# EAGLE design einstein_v1_1 (EAGLE 8.4.1)
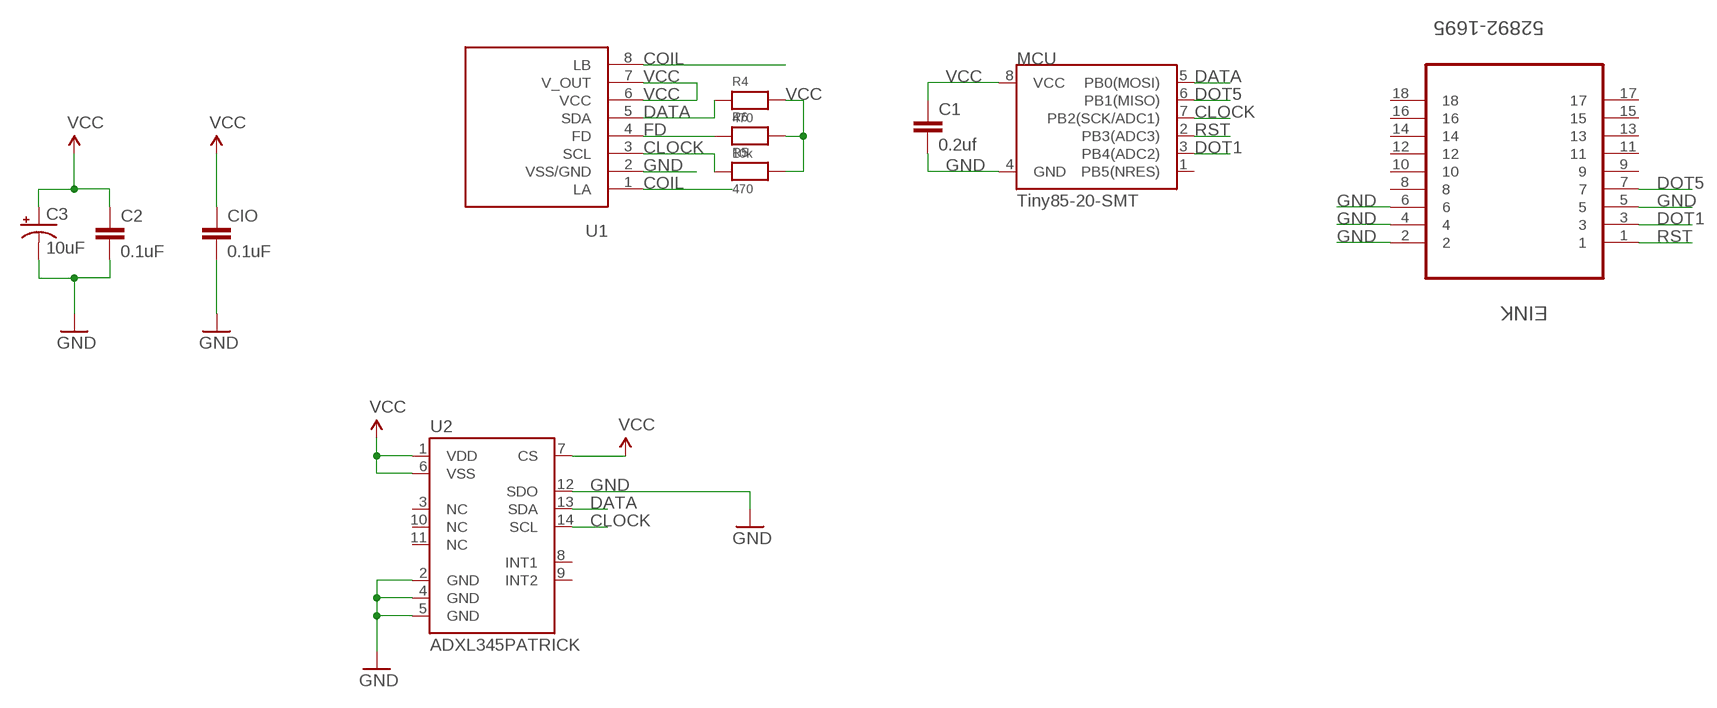
[diagram p0: schematic, sheet 1]

## Parts
C1  0.2uf  CAP1206  [1206]
C2  0.1uF  CAP0603-CAP  [0603-CAP]
C3  10uF  CAP_POL1206  [EIA3216]
CIO  0.1uF  CAP0603-CAP  [0603-CAP]
EINK  52892-1695  [MOLEX_52892-1695]
MCU  Tiny85-20-SMT  ATTINY45TINY85-20-SMT  [SO08-EIAJ]
R4  470  RESISTOR0603  [0603]
R5  470  RESISTOR0603  [0603]
R6  10k  RESISTOR0603  [0603]
U1  NT3H1101  [NT3H1101]
U2  ADXL345PATRICK  [LGA14_1:1_PATRICK]

## Nets
CLOCK: MCU.7(PB2(SCK/ADC1)) R5.1 U1.3(SCL) U2.14(SCL)
COIL: U1.1(LA) U1.8(LB)
DATA: MCU.5(PB0(MOSI)) R4.1 U1.5(SDA) U2.13(SDA)
DOT1: EINK.3 MCU.3(PB4(ADC2))
DOT5: EINK.7 MCU.6(PB1(MISO))
FD: R6.1 U1.4(FD)
GND: C1.2 C2.2 C3.C(-) CIO.2 EINK.2 EINK.4 EINK.5 EINK.6 MCU.4(GND) U1.2(VSS/GND) U2.2(GND) U2.4(GND) U2.5(GND) U2.12(SDO)
RST: EINK.1 MCU.2(PB3(ADC3))
VCC: C1.1 C2.1 C3.A(+) CIO.1 MCU.8(VCC) R4.2 R5.2 R6.2 U1.6(VCC) U1.7(V_OUT) U2.1(VDD) U2.6(VSS) U2.7(CS)
Unconnected: EINK.8 EINK.9 EINK.10 EINK.11 EINK.12 EINK.13 EINK.14 EINK.15 EINK.16 EINK.17 EINK.18 MCU.1(PB5(NRES)) U2.3(NC) U2.8(INT1) U2.9(INT2) U2.10(NC) U2.11(NC)

## Library data of the parts
C1 = SparkFun-Capacitors:CAP: Capacitor Standard 0603 ceramic capacitor, and 0.1" leaded capacitor.
C2 CIO = SparkFun:CAP: Capacitor Standard 0603 ceramic capacitor, and 0.1" leaded capacitor.
C3 = SparkFun:CAP_POL: Capacitor Polarized These are standard SMD and PTH capacitors. Normally 10uF, 47uF, and 100uF in electrolytic and tantalum varieties. Always verify the external diameter of the through hole cap, it varies with capacity, voltage, and manufacturer. The EIA devices should be standard.
EINK = Molex_By_element14_Batch_1:52892-1695: CONNECTOR, FPC, ZIF, 0.50MM, 16 WAY; MPN: 52892-1695; OC_FARNELL: 1556807; OC_NEWARK: 92M6601; PACKAGE: CONNECTOR, FPC, ZIF, 0.50MM, 16 WAY; SUPPLIER: Molex
MCU = SparkFun-DigitalIC:ATTINY45: Atmel 8-pin 2/4/8kB flash uC; PROD_ID: IC-09092
R4-R6 = microbuilder:RESISTOR: Resistors 0402 - 0402 Surface Mount Package 22 Ohm 1% 1/16W [Digikey: 311-22.0LRTR-ND] 33 Ohm 5% 1/16W 1.0K 5% 1/16W 1.5K 5% 1/16W 2.0K 1% 1/16W 10.0K 1% 1/16W [Digikey: 311-10.0KLRTR-ND] 10.0K 5% 1/16W [Digikey: RMCF0402JT10K0TR-ND] 12.1K 1% 1/16W [Digikey: 311-22.0LRTR-ND] 100.0K 5% 1/16W 0603 - 0603 Surface Mount Package 0 Ohm 1/10 Watt 1% Resistor 15 Ohm 1/10 Watt 1% Resistor 33 Ohm 1/10 Watt 1% Resistor 49.9 Ohm 1/10 Watt 1% Resistor 100 Ohm 1/10 Watt 1% Resistor 150 Ohm 1/10 Watt 1% Resistor 240 Ohm 1/10 Watt 1% Resistor 390 Ohm 1/10 Watt 1% Resistor 560 Ohm 1/10 Watt 1% Resistor 680 Ohm 1/10 Watt 1% Resistor 750 Ohm 1/10 Watt 1% Resistor 1.0K Ohm 1/10 Watt 1% Resistor 1.5K Ohm 1/10 Watt 1% Resistor 2.0K Ohm 1/10 Watt 1% Resistor 2.2K Ohm 1/10 Watt 1% Resistor 3.3K Ohm 1/10 Watt 1% Resistor 4.7K Ohm 1/10 Watt 1% Resistor 10.0K Ohm 1/10 Watt 1% Resistor 12.0K Ohm 1/10 Watt 1% Resistor 12.1K Ohm 1/10 Watt 1% Resistor 20.0K Ohm 1/10 Watt 1% Resistor 33.0K Ohm 1/10 Watt 1% Resistor 100.0K Ohm 1/10 Watt 1% Resistor 0805 - 0805 Surface Mount Package 0 Ohm 1/8 Watt 1% Resistor 33 Ohm 1/8 Watt 1% Resistor 100 Ohm 1/8 Watt 1% Resistor 150 Ohm 1/8 Watt 1% Resistor 200 Ohm 1/8 Watt 1% Resistor 240 Ohm 1/8 Watt 1% Resistor 330 Ohm 1/8 Watt 1% Resistor 390 Ohm 1/8 Watt 1% Resistor 470 Ohm 1/8 Watt 1% Resistor 1.0K Ohm 1/8 Watt 1% Resistor 1.5K Ohm 1/8 Watt 1% Resistor 2.0K Ohm 1/8 Watt 1% Resistor 4.7K Ohm 1/8 Watt 1% Resistor 5.1K Ohm 1/8 Watt 1% Resistor 5.6K Ohm 1/8 Watt 1% Resistor 10.0K Ohm 1/8 Watt 1% Resistor 22.0K Ohm 1/8 Watt 1% Resistor 33.0K Ohm 1/8 Watt 1% Resistor 100K Ohm 1/8 Watt 1% Resistor 1206 - 1206 Surface Mount Package 2012 - 2010 Surface Mount Package 0.11 Ohm 1/2 Watt 1% Resistor - Digikey: RHM.11UCT-ND
U1 = AlterNail:NT3H1101
U2 = Testing:ADXL345

## Board
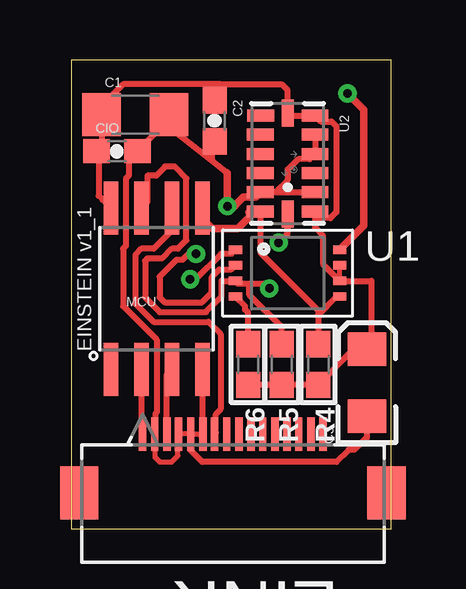
[diagram p1: board, top side]
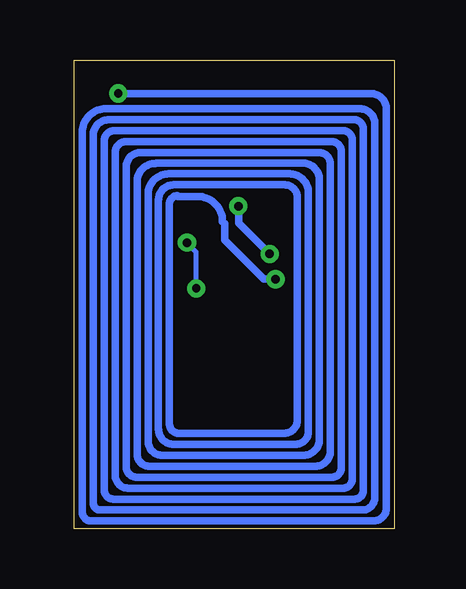
[diagram p2: board, bottom side, seen from below]

Size 13.34 x 19.56 mm. Coordinates in mm from the lower left corner, seen from the top.
Outline: 0,0 13.34,0 13.34,19.56 0,19.56 0,0
Copper layers (1*16): Top 0.035mm / dielectric 1.5mm / Bottom 0.035mm
Design rules "default *": minimum track width 10mil, minimum drill 24mil, track to track 8mil, track to pad 8mil, pad to pad 8mil, via to via 8mil, smd to smd 8mil, copper to edge 40mil, drill to drill 6mil, minimum pad ring 10mil, minimum via ring 8mil, stop-mask expansion 4mil, vias tented up to drill 0mil, thermal gap 10mil

### Footprints (pad centres in the part's own frame; a part is rotated, then mirrored left to right if it is on the bottom)
1206 = smd 1.6 x 1.8: 1 -1.4,0; 2 1.4,0
0603-CAP = smd 1.1 x 1: 1 -0.85,0; 2 0.85,0
EIA3216 = smd 1.4 x 1.6: A 1.4,0; C -1.4,0
MOLEX_52892-1695 = smd 0.305 x 1.397: 1 3.759,2.896; 2 3.251,2.896; 3 2.743,2.896; 4 2.261,2.896; 5 1.753,2.896; 6 1.245,2.896; 7 0.762,2.896; 8 0.254,2.896; 9 -0.254,2.896; 10 -0.762,2.896; 11 -1.245,2.896; 12 -1.753,2.896; 13 -2.261,2.896; 14 -2.743,2.896; 15 -3.251,2.896; 16 -3.759,2.896 | smd 1.6 x 2.21: 17 -6.401,5.359; 18 6.401,5.359
SO08-EIAJ = smd 0.61 x 2.21: 1 -1.905,-3.378; 2 -0.635,-3.378; 3 0.635,-3.378; 4 1.905,-3.378; 5 1.905,3.353; 6 0.635,3.353; 7 -0.635,3.353; 8 -1.905,3.353
0603 = smd 1.1 x 1: 1 -0.85,0; 2 0.85,0
NT3H1101 = smd 0.55 x 0.35: 1 -2.175,0.975; 2 -2.175,0.325; 3 -2.175,-0.325; 4 -2.175,-0.975; 5 2.175,-0.975; 6 2.175,-0.325; 7 2.175,0.325; 8 2.175,0.975; P$5 -2.175,-0.325
LGA14_1:1_PATRICK = smd 0.5 x 1.124: 1 2,1.138; 2 1.2,1.138; 3 0.4,1.138; 4 -0.4,1.138; 5 -1.2,1.138; 6 -2,1.138; 8 -2,-1.13; 9 -1.2,-1.138; 10 -0.4,-1.138; 11 0.4,-1.138; 12 1.2,-1.138; 13 2,-1.138 | smd 1.124 x 0.5: 7 -2.1,0; 14 2.1,0

### Placement (x,y rotation side)
C1  2.67,17.27 0 top
C2  5.97,17.02 270 top
C3  12.32,6.1 90 top
CIO  1.91,15.75 0 top
EINK  6.73,6.86 180 top
MCU  3.56,10.03 0 top
R4  10.29,6.86 270 top
R5  8.76,6.86 270 top
R6  7.37,6.86 270 top
U1  9.02,10.67 0 top
U2  9.02,15.24 270 top

### Tracks (layer width: path | path; a pad name or v marks a point on that pad's centre or on a via)
CLOCK  (via drill 0.35)
  Top 0.203: 6.77,10.41 U1.3 6.95,10.23
  Top 0.254: 8.64,8.13 R5.1 8.76,8.42 7.42,9.76 7.42,10.23 | MCU.7 3.17,13.64 3.17,14.73 3.53,14.73 3.91,15.11 4.3,15.11 4.8,14.62 4.8,12.04 4.45,11.68 4.19,11.68 3.79,11.28 3.17,11.28 3.07,11.18 3.07,9.65 3.68,9.04 5.61,9.04 6.26,9.69 6.26,10.34 U1.3 | 6.95,10.23 7.42,10.23 | 7.42,10.23 8.06,10.23 v8.25,10.03 | v8.64,11.94 9.02,12.32 U2.14
  Bottom 0.203: v8.25,10.03 8.25,11.55 v8.64,11.94
COIL  (via drill 0.35)
  Top 0.254: U1.1 6.67,11.47 6.24,11.47 5.18,10.41
  Top 0.305: 5.18,10.41 v4.95,10.41 | U1.8 12.2,12.65 12.2,17.48 v11.51,18.16
  Bottom 0.203: 10.26,3.73 10.26,3.66
  Bottom 0.305: 10.26,3.66 arc-90 9.68,3.07 3.79,3.07 arc-90 3.12,3.73 3.12,14.55 arc-90 3.83,15.27 9.93,15.27 9.96,15.24 arc-90 10.72,14.48 10.72,3.12 arc-90 10.21,2.62 3.3,2.62 arc-90 2.67,3.25 2.67,15.21 arc-90 3.15,15.7 10.57,15.7 arc-90 11.18,15.09 11.18,2.59 arc-90 10.74,2.16 2.59,2.16 arc-90 2.21,2.54 2.21,15.75 arc-90 2.62,16.15 11.18,16.15 arc-90 11.63,15.7 11.63,2.24 arc-90 11.1,1.7 2.13,1.7 arc-90 1.75,2.08 1.75,16.23 arc-90 2.13,16.61 11.66,16.61 arc-90 12.09,16.18 12.09,1.63 arc-90 11.71,1.25 1.65,1.25 arc-90 1.29,1.6 1.29,16.69 arc-90 1.68,17.07 11.89,17.07 arc-90 12.55,16.41 12.55,1.09 arc-90 12.24,0.79 1.35,0.79 arc-90 0.81,1.32 0.81,16.89 arc-90 1.45,17.53 12.01,17.53 arc-90 13.01,16.54 13.01,0.71 arc-90 12.62,0.33 0.89,0.33 arc-90 0.33,0.89 0.33,17.5 arc-90 0.99,18.16 v11.5,18.16 v11.51,18.16 | 10.26,3.73 10.26,13.95 arc90 9.4,14.81 4.37,14.81 arc90 3.58,14.02 3.58,4.06 arc90 4.12,3.53 9.2,3.53 arc90 9.83,4.17 9.83,13.72 arc90 9.2,14.35 4.57,14.35 arc90 4.04,13.82 4.04,4.55 arc90 4.6,3.99 8.97,3.99 arc90 9.37,4.39 9.37,13.56 arc90 9.04,13.89 9.02,13.87 8.2,13.87 arc90 7.16,12.83 7.06,12.72 7.06,12.04 5.44,10.41 v4.95,10.41
DATA
  Top 0.203: 11.05,9.69 U1.5 | 10.29,8.93 10.29,7.85 R4.1
  Top 0.254: 9.91,8.13 R4.1 | 5.46,13.21 MCU.5 | 7.37,13.21 7.63,13.22 U2.13 7.88,11.53 10.29,9.12 10.29,7.85 | 10.29,8.93 11.05,9.69
  Top 0.305: MCU.5 5.46,12.93 5.87,12.52 6.93,12.52 7.63,13.22
DOT1
  Top 0.203: 3.99,6.45 MCU.3
  Top 0.254: EINK.3 3.99,6.45
DOT5
  Top 0.203: EINK.7 6.02,4.01 | MCU.6 4.19,12.45
  Top 0.254: 6.02,4.01 6.02,4.79 6.22,4.99 6.22,8.13 5.71,8.64 3.43,8.64 2.67,9.4 2.67,11.43 2.92,11.68 3.43,11.68 4.19,12.45
FD
  Top 0.254: R6.1 7.37,9.02 7.24,9.14 7.24,9.3 U1.4
GND  (via drill 0.35)
  Top 0.203: EINK.2 3.48,3 3.68,2.79 4.19,2.79 4.45,3.05 4.45,3.94 EINK.4 4.95,3.96 EINK.5 5.32,3.96 5.47,3.81 | 12.05,4.97 C3.C | 3.76,10.6 3.68,10.52
  Top 0.254: MCU.4 5.46,4.32 EINK.6 5.47,3.81 5.46,3.68 | 12.45,4.95 C3.C | 12.45,4.32 C3.C | C3.C 12.32,3.81 11.81,3.3 11.56,3.3 11.05,2.79 5.46,2.79 4.95,3.3 4.95,3.96 | 7.81,13.97 U2.12 8.51,14.04 | CIO.2 3.17,15.66 | 8.51,14.04 U2.2 | 8.51,14.04 9.02,14.55 9.02,14.99 9.46,15.42 9.94,15.42 U2.4 U2.5 | 4.11,16.73 C1.2 | 5.86,15.35 4.11,16.73 | 6.48,14.86 5.86,15.35 | CIO.2 3.13,15.75 | EINK.2 3.48,4.55 3.5,4.57 3.5,4.8 3.56,4.85 3.56,7.9 2.16,9.29 2.16,11.68 2.29,11.81 2.29,14.63 2.41,14.75 2.41,15.49 2.67,15.75 CIO.2 | CIO.2 3.74,16.73 4.11,16.73 | C2.2 5.86,16.06 5.86,15.35 | U1.2 6.67,10.82 6.17,10.82 5.86,10.51 5.86,9.86 5.45,9.45 3.89,9.45 3.68,9.65 3.68,10.52 4.39,11.23 4.63,11.23 4.88,11.47 v5.2,11.47
  Top 0.305: 6.48,14.86 6.5,14.84 v6.5,13.46 6.81,13.46 6.96,13.64 7.17,13.85 7.68,13.85 7.81,13.97
  Bottom 0.305: v5.2,11.47 6.48,12.75 6.48,13.44 v6.5,13.46
RST
  Top 0.254: MCU.2 2.92,4.32 EINK.1
VCC
  Top 0.203: U1.6 U1.7 | C3.A 11.78,7.5
  Top 0.254: 1.65,13.84 MCU.8 | R6.2 7.37,6.22 | 9.91,6.22 R4.2 | 8.64,6.22 R5.2 | 11.81,7.49 C3.A 12.76,7.94 | 10.54,6.22 R4.2 | 1.65,12.57 MCU.8 | 7.37,5.59 R6.2 | 11.78,7.5 R4.2 | R4.2 R5.2 | R5.2 R6.2 | MCU.8 1.31,13.73 | 6.22,18.54 8.76,18.54 9.02,18.29 U2.7 9.12,17.24 U2.6 10.4,17 10.84,17 11.05,16.79 11.05,13.21 10.79,12.95 10.15,12.95 | 6.22,18.54 2.16,18.54 1.27,17.65 C1.1 1.27,16.13 1.14,16 | C2.1 6.22,18.12 6.22,18.54 | MCU.8 1.14,13.89 1.14,16 | CIO.1 1.06,15.91 1.14,16 | 12.76,7.94 12.83,8 | 10.19,13.21 U2.1 10.15,12.95 | 12.76,7.94 12.5,8.2 12.5,10.34 U1.6 10.49,11.05 10.49,12.23 10.15,12.56 10.15,12.95

### Text on the board
tNames: EINSTEIN v1_1